# Altium schematic sheet Pressure ADC.SchDoc
size Letter
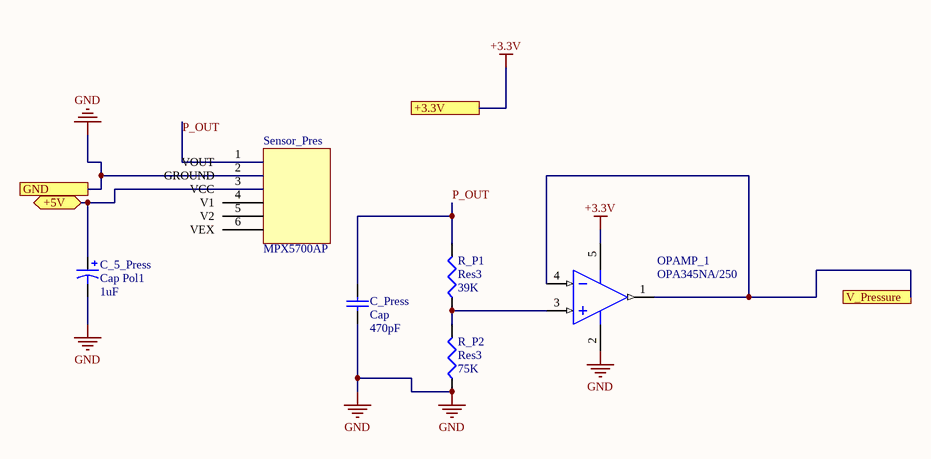
[diagram p0: Pressure ADC.SchDoc]

## Parts
C_5_Press  Cap Pol1  value 1uF  [Capacitor S Panasonic]
C_Press  Cap  value 470pF  [J1-0603]
OPAMP_1  OPA345NA/250  [TI-DBV5_N]
R_P1  Res3  value 39K  [J1-0603]
R_P2  Res3  value 75K  [J1-0603]
Sensor_Pres  MPX5700AP  [HDR1X6H]

## Ports
+3.3V, +5V, GND, V_Pressure

## Nets
+3.3V: OPAMP_1.5(V+) ; port +3.3V
GND: C_5_Press.2 C_Press.1 OPAMP_1.2(V-) R_P2.1 Sensor_Pres.2(GROUND) ; port GND
+5V: C_5_Press.1 Sensor_Pres.3(VCC) ; port +5V
P_OUT: C_Press.2 R_P1.2 Sensor_Pres.1(VOUT)
V_Pressure: OPAMP_1.1(OUT) OPAMP_1.4(IN-) ; port V_Pressure
NetOPAMP_1_3: OPAMP_1.3(IN+) R_P1.1 R_P2.2

Not connected (* = marked no-connect by the designer): Sensor_Pres 4(V1) 5(V2) 6(VEX)

## Library data of the parts
C_5_Press = Cap Pol1: Polarized Capacitor (Radial); Published: 8-Jun-2000; LatestRevisionDate: 17-Jul-2002; LatestRevisionNote: Re-released for DXP Platform.; PackageReference: RB7.6-15; Publisher: Altium Limited; PackageDescription: Polarized Capacitor (Radial); 2 Leads
C_Press = Cap: Capacitor; Published: 8-Jun-2000; LatestRevisionDate: 17-Jul-2002; LatestRevisionNote: Re-released for DXP Platform.; PackageReference: RAD-0.3; Publisher: Altium Limited; PackageDescription: Radial Cap, Thru-Hole; 2 Leads; 0.3 in Pin Spacing
OPAMP_1 = OPA345NA/250: Low Power, Single-Supply, Rail-to-Rail Operational Amplifier MicroAmplifier(TM) Series, 2.7 to 5.5 V, -55 to 125 degC, 5-pin SOT23 (DBV5), Green (RoHS & no Sb/Br); Manufacturer: Texas Instruments; CMRR(Min)(dB): 76; IIB(Max)(pA): 10; Iq per channel(Max)(mA): 0.25; Number of Channels: 1; Offset Drift(Typ)(uV/C): 3; Slew Rate(Typ)(V/us): 2; Sub Family: Low Input Bias Current Amp (<=10pA), Low Power Amp (<=500uA), Low Supply Voltage Amplifier (<=2.7V), Precision Amplifier; Total Supply Voltage(Max)(+5V is 5, +/-5V is 10): 5.5; Total Supply Voltage(Min)(+5V is 5, +/-5V is 10): 2.7; DatasheetVersion: SBOS107A; PackageVersion: 4073253-4/K, 03/2006; PackageReference: DBV5; PackageDescription: 5-Pin Plastic Small Outline, Body 1.6 x 2.9 mm, Pitch 0.95 mm; Supplier 1: Digi-Key; Supplier Part Number 1: OPA345NATR-ND; Supplier 2: Digi-Key; Supplier Part Number 2: OPA345NACT-ND; Supplier 3: Digi-Key; Supplier Part Number 3: OPA345NADKR-ND; Supplier 4: Farnell; Supplier Part Number 4: 1648703; Supplier 5: Newark; Supplier Part Number 5: 75C4876; Supplier 6: Mouser; Supplier Part Number 6: 595-OPA345NA/250; Eco-Plan: Green (RoHS & no Sb/Br); Vio (25C)(Max)(mV): 1; Mounting Technology: Surface Mount; Code_JEDEC: MO-178; PartNumber: OPA345NA/250; ComponentLink1Description: Manufacturer URL; ComponentLink1URL: http://www.ti.com/; ComponentLink2Description: Datasheet; ComponentLink2URL: http://www.ti.com/general/docs/lit/getliterature.tsp?genericPartNumber=OPA345&fileType=pdf; ComponentLink3Description: Package Specification; ComponentLink3URL: http://www.ti.com/litv/pdf/mpds018i
R_P1 R_P2 = Res3: Resistor; Published: 8-Jun-2000; LatestRevisionDate: 29-May-2009; LatestRevisionNote: IPC-7351 Footprint Added.; PackageReference: J1-0603; Publisher: Altium Limited; PackageDescription: Chip Resistor